# EAGLE design right (EAGLE 9.5.1)
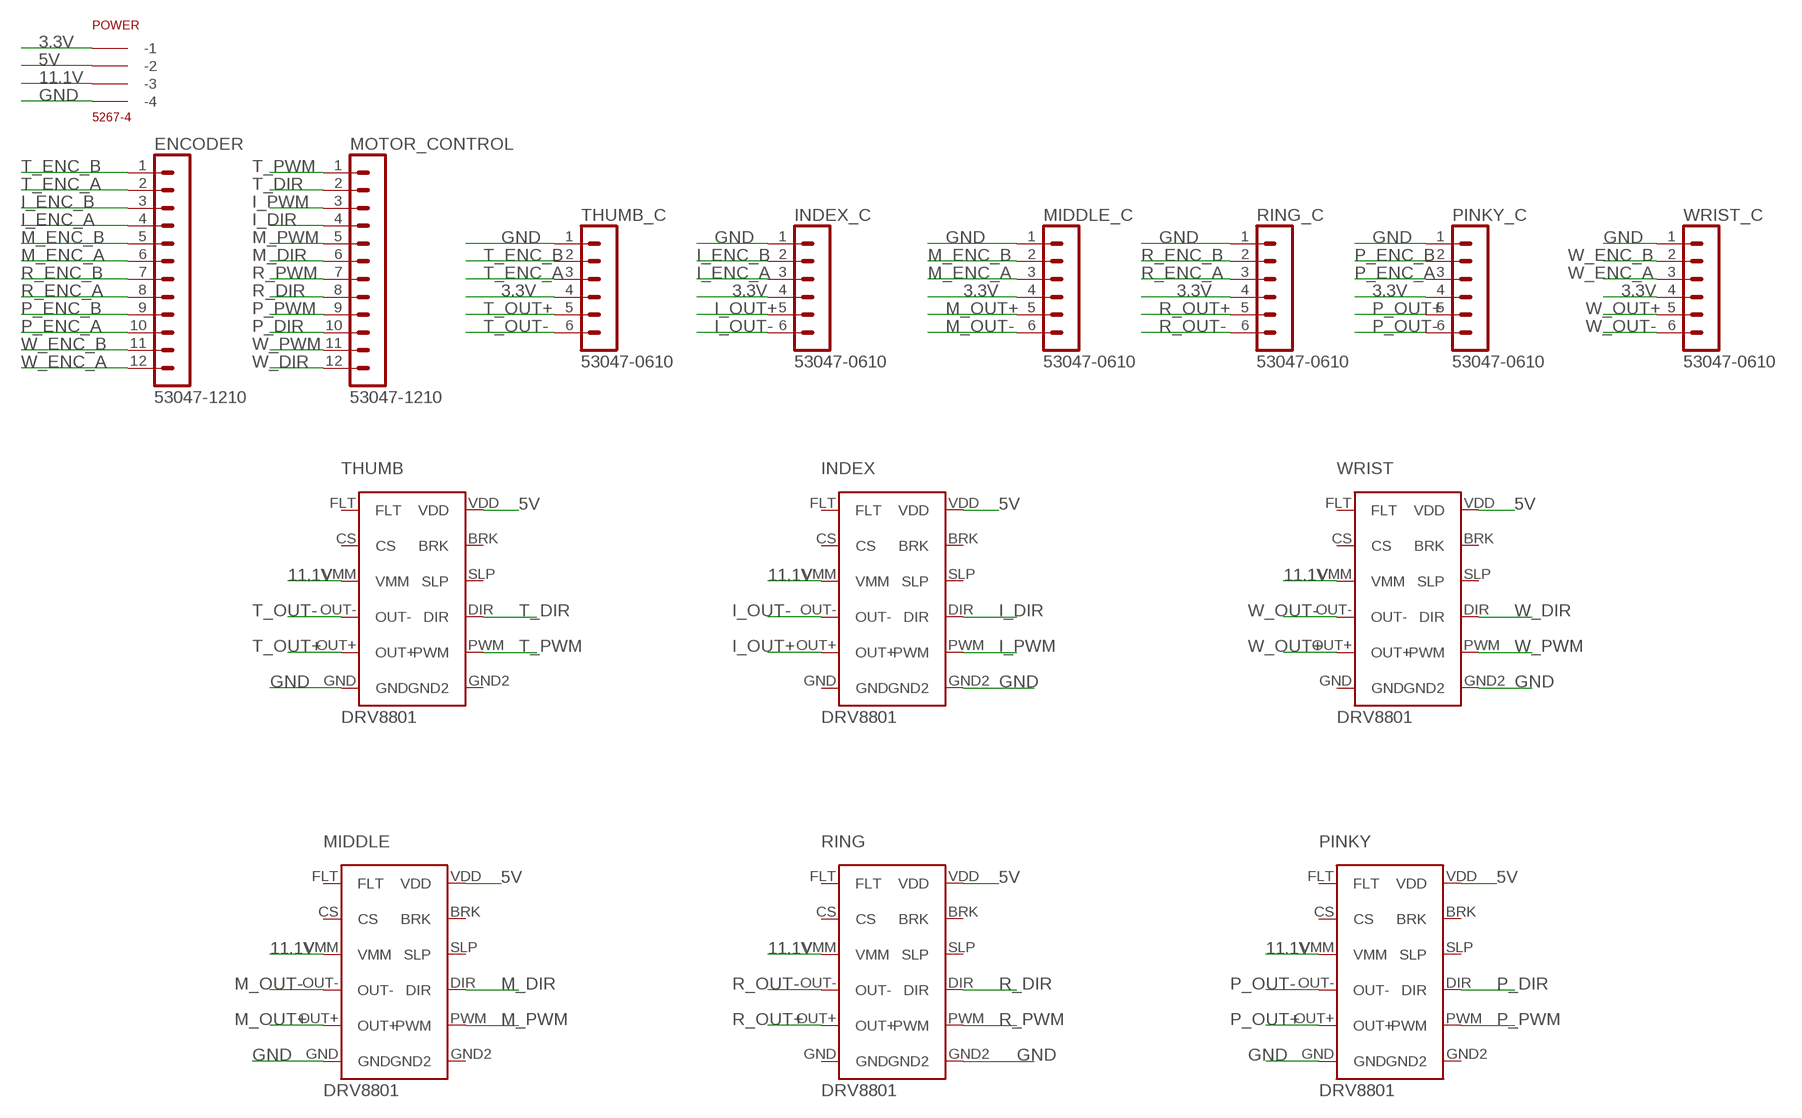
[diagram p0: schematic, sheet 1]

## Parts
ENCODER  53047-1210  [53047-1210]
INDEX  DRV8801  [DRV8801]
INDEX_C  53047-0610  [53047-0610]
MIDDLE  DRV8801  [DRV8801]
MIDDLE_C  53047-0610  [53047-0610]
MOTOR_CONTROL  53047-1210  [53047-1210]
PINKY  DRV8801  [DRV8801]
PINKY_C  53047-0610  [53047-0610]
POWER  5267-4  [5267-4]
RING  DRV8801  [DRV8801]
RING_C  53047-0610  [53047-0610]
THUMB  DRV8801  [DRV8801]
THUMB_C  53047-0610  [53047-0610]
WRIST  DRV8801  [DRV8801]
WRIST_C  53047-0610  [53047-0610]

## Nets
3.3V: INDEX_C.4 MIDDLE_C.4 PINKY_C.4 POWER.P$1(-1) RING_C.4 THUMB_C.4 WRIST_C.4
5V: INDEX.VDD MIDDLE.VDD PINKY.VDD POWER.P$2(-2) RING.VDD THUMB.VDD WRIST.VDD
11.1V: INDEX.VMM MIDDLE.VMM PINKY.VMM POWER.P$3(-3) RING.VMM THUMB.VMM WRIST.VMM
GND: INDEX.GND2 INDEX_C.1 MIDDLE.GND MIDDLE_C.1 PINKY.GND PINKY_C.1 POWER.P$4(-4) RING.GND2 RING_C.1 THUMB.GND THUMB_C.1 WRIST.GND2 WRIST_C.1
I_DIR: INDEX.DIR MOTOR_CONTROL.4
I_ENC_A: ENCODER.4 INDEX_C.3
I_ENC_B: ENCODER.3 INDEX_C.2
I_OUT+: INDEX.OUT+ INDEX_C.5
I_OUT-: INDEX.OUT- INDEX_C.6
I_PWM: INDEX.PWM MOTOR_CONTROL.3
M_DIR: MIDDLE.DIR MOTOR_CONTROL.6
M_ENC_A: ENCODER.6 MIDDLE_C.3
M_ENC_B: ENCODER.5 MIDDLE_C.2
M_OUT+: MIDDLE.OUT+ MIDDLE_C.5
M_OUT-: MIDDLE.OUT- MIDDLE_C.6
M_PWM: MIDDLE.PWM MOTOR_CONTROL.5
P_DIR: MOTOR_CONTROL.10 PINKY.DIR
P_ENC_A: ENCODER.10 PINKY_C.3
P_ENC_B: ENCODER.9 PINKY_C.2
P_OUT+: PINKY.OUT+ PINKY_C.5
P_OUT-: PINKY.OUT- PINKY_C.6
P_PWM: MOTOR_CONTROL.9 PINKY.PWM
R_DIR: MOTOR_CONTROL.8 RING.DIR
R_ENC_A: ENCODER.8 RING_C.3
R_ENC_B: ENCODER.7 RING_C.2
R_OUT+: RING.OUT+ RING_C.5
R_OUT-: RING.OUT- RING_C.6
R_PWM: MOTOR_CONTROL.7 RING.PWM
T_DIR: MOTOR_CONTROL.2 THUMB.DIR
T_ENC_A: ENCODER.2 THUMB_C.3
T_ENC_B: ENCODER.1 THUMB_C.2
T_OUT+: THUMB.OUT+ THUMB_C.5
T_OUT-: THUMB.OUT- THUMB_C.6
T_PWM: MOTOR_CONTROL.1 THUMB.PWM
W_DIR: MOTOR_CONTROL.12 WRIST.DIR
W_ENC_A: ENCODER.12 WRIST_C.3
W_ENC_B: ENCODER.11 WRIST_C.2
W_OUT+: WRIST.OUT+ WRIST_C.5
W_OUT-: WRIST.OUT- WRIST_C.6
W_PWM: MOTOR_CONTROL.11 WRIST.PWM
Unconnected: INDEX.BRK INDEX.CS INDEX.FLT INDEX.GND INDEX.SLP MIDDLE.BRK MIDDLE.CS MIDDLE.FLT MIDDLE.GND2 MIDDLE.SLP PINKY.BRK PINKY.CS PINKY.FLT PINKY.GND2 PINKY.SLP RING.BRK RING.CS RING.FLT RING.GND RING.SLP THUMB.BRK THUMB.CS THUMB.FLT THUMB.GND2 THUMB.SLP WRIST.BRK WRIST.CS WRIST.FLT WRIST.GND WRIST.SLP

## Library data of the parts
ENCODER MOTOR_CONTROL = con-molex-picoblade:53047-1210: HEADER
INDEX MIDDLE PINKY RING THUMB WRIST = DRV8801:DRV8801
INDEX_C MIDDLE_C PINKY_C RING_C THUMB_C WRIST_C = con-molex-picoblade:53047-0610: HEADER
POWER = con-molex-spox:5267-4

## Board
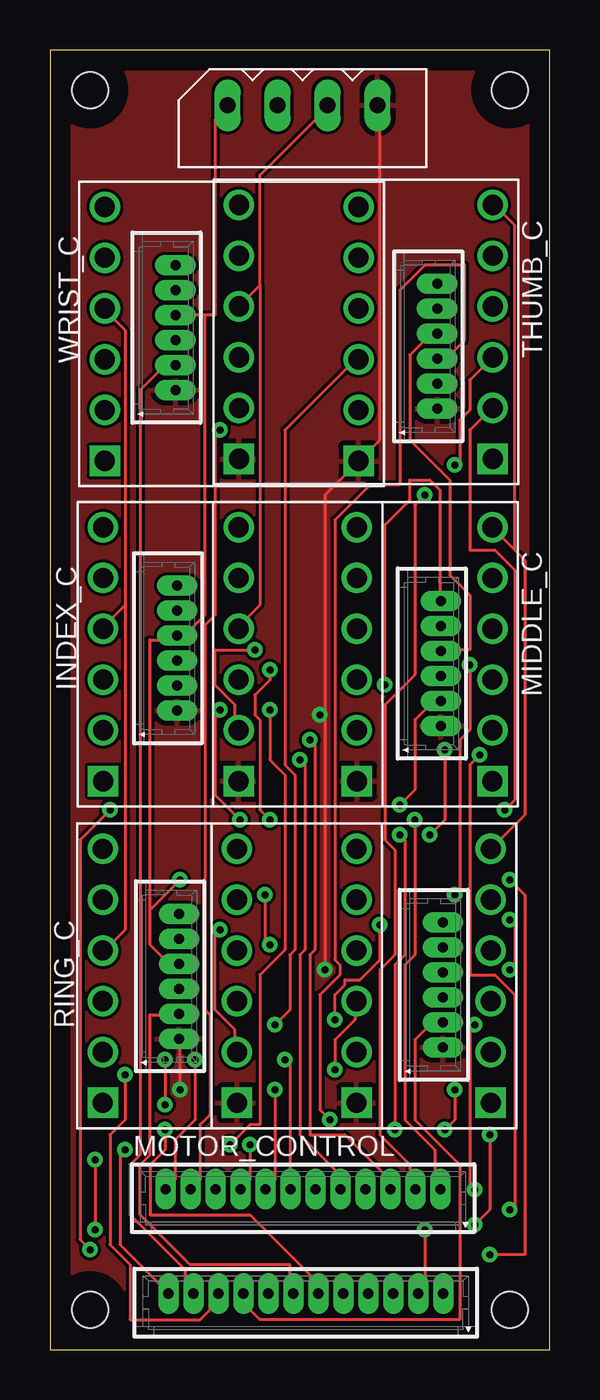
[diagram p1: board, top side]
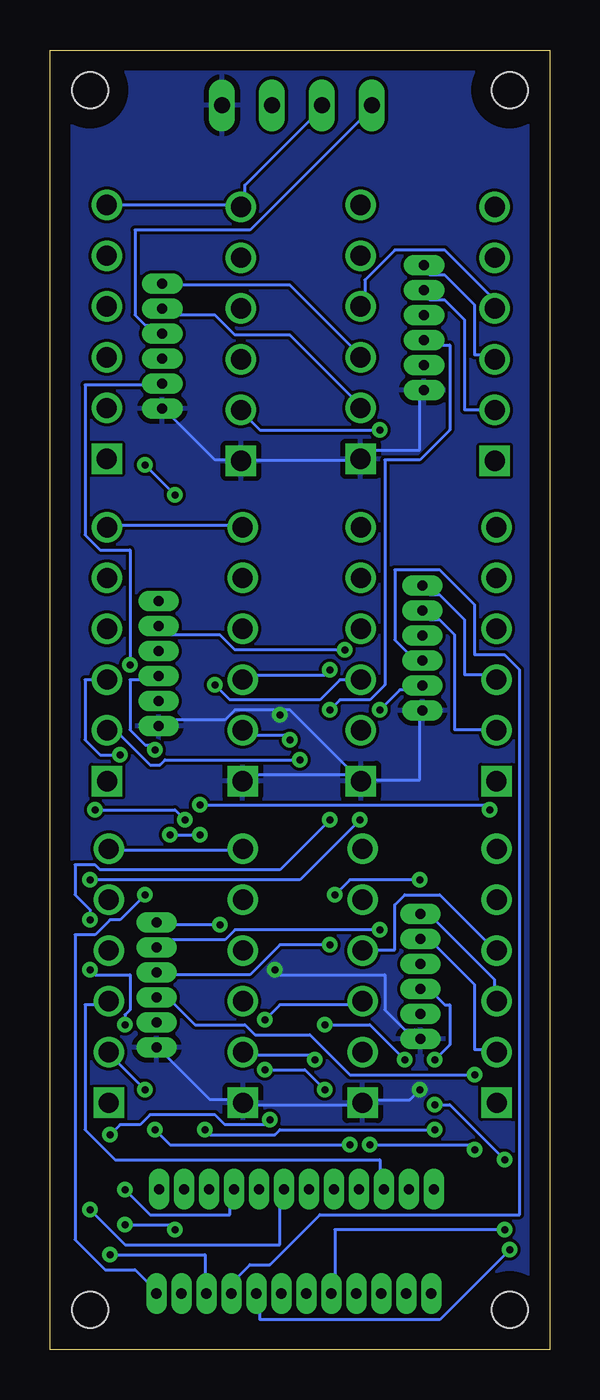
[diagram p2: board, bottom side, seen from below]

Size 25 x 65 mm. Coordinates in mm from the lower left corner, seen from the top.
Outline: 0,0 25,0 25,65 0,65 0,0
Copper layers (1*16): Top 0.035mm / dielectric 1.5mm / Bottom 0.035mm
Design rules "default": minimum track width 6mil, minimum drill 0.35mm, track to track 6mil, track to pad 6mil, pad to pad 6mil, via to via 6mil, smd to smd 6mil, copper to edge 40mil, drill to drill 6mil, minimum pad ring 10mil, minimum via ring 8mil, stop-mask expansion 4mil, vias tented up to drill 0mil, thermal gap 10mil
Holes 1.8 mm at 23,63 2,63 2,2 23,2

### Footprints (pad centres in the part's own frame; a part is rotated, then mirrored left to right if it is on the bottom)
53047-1210 = drill 0.508 long: 1 6.875,0; 2 5.625,0; 3 4.375,0; 4 3.125,0; 5 1.875,0; 6 0.625,0; 7 -0.625,0; 8 -1.875,0; 9 -3.125,0; 10 -4.375,0; 11 -5.625,0; 12 -6.875,0
DRV8801 = drill 1.016: BRK 6.35,3.81; CS -6.35,3.81; DIR 6.35,-1.27; FLT -6.35,6.35; OUT+ -6.35,-3.81; OUT- -6.35,-1.27; PWM 6.35,-3.81; SLP 6.35,1.27; VDD 6.35,6.35; VMM -6.35,1.27 | drill 1.016 square: GND -6.35,-6.35; GND2 6.35,-6.35
53047-0610 = drill 0.508 long: 1 3.125,0; 2 1.875,0; 3 0.625,0; 4 -0.625,0; 5 -1.875,0; 6 -3.125,0
5267-4 = drill 0.8 long: P$1 0,0; P$2 2.5,0; P$3 5,0; P$4 7.5,0

### Placement (x,y rotation side)
ENCODER  12.8,2.8 0 top
INDEX  9.01,34.78 0 top
INDEX_C  6.36,35.08 270 top
MIDDLE  15.79,34.78 0 top
MIDDLE_C  19.56,34.31 270 top
MOTOR_CONTROL  12.67,8.02 0 top
PINKY  15.71,18.69 0 top
PINKY_C  19.66,18.24 270 top
POWER  8.89,62.23 0 top
RING  8.99,18.69 0 top
RING_C  6.46,18.67 270 top
THUMB  15.81,50.9 0 top
THUMB_C  19.38,50.18 270 top
WRIST  9.09,50.8 0 top
WRIST_C  6.28,51.11 270 top

### Tracks (layer width: path | path; a pad name or v marks a point on that pad's centre or on a via)
3.3V  (via drill 0.35)
  Top 0.152: MIDDLE_C.4 19.75,35 21,35 21,37.75 20,38.75 20,43.5 18,45.5 18,49.75 19.25,51 THUMB_C.4 | 7.75,51.75 8.25,51.75 8.25,61.5 8.75,62 POWER.P$1 | 7.75,51.75 6.5,51.75 WRIST_C.4 | v11,20.25 10.75,20.5 v10.75,22.75 | 5,22 v6.5,23.5 | 5,22 5,20.25 5.75,19.5 6.25,19.5 RING_C.4 | 5,22 5,35.5 6.25,35.5 INDEX_C.4 6.5,35.5 7.75,36.75 7.75,51.75
  Bottom 0.152: v11,20.25 13.5,20.25 15,18.75 19.5,18.75 PINKY_C.4 | v10.75,22.75 10,23.5 v6.5,23.5 | THUMB_C.4 19.5,51 19.75,51.25 20.25,51.25 20.75,51.75 20.75,56 15,56 9,62 POWER.P$1
5V
  Top 0.152: 23.25,40 22.25,41 MIDDLE.VDD | 23.25,40 23.75,39.5 23.75,26.75 22.25,25.25 PINKY.VDD | 23.25,40 23.25,56.25 22.25,57.25 THUMB.VDD
  Bottom 0.152: POWER.P$2 11.5,62 15.25,58.25 15.25,57.25 WRIST.VDD 15.5,57.25 THUMB.VDD | RING.VDD 15.5,25 22,25 PINKY.VDD | INDEX.VDD 15.5,41.25 22,41.25 MIDDLE.VDD
11.1V
  Top 0.152: 10.5,53.25 10.5,58.75 13.75,62 POWER.P$3 | 10.5,53.25 9.5,52.25 THUMB.VMM | 10.5,53.25 10.5,37.25 9.5,36.25 MIDDLE.VMM | 3.75,37.25 2.75,36.25 INDEX.VMM | 3.75,37.25 3.75,51 2.75,52 WRIST.VMM | 3.75,37.25 3.75,21 2.75,20 RING.VMM
  Bottom 0.152: RING.VMM 2.75,20 5.5,22.75 7.25,22.75 7.75,22.25 7.75,20 9.25,20 PINKY.VMM | THUMB.VMM 9.25,52.25 9.25,53.5 7.75,55 5.25,55 2.5,52.25 WRIST.VMM
GND  (via drill 0.35)
  Top 0.152: v6.5,13 6.5,15.5 RING_C.1 | POWER.P$4 16.5,62 16.5,45.5 15.5,44.5 WRIST.GND2 15.25,44.25 13.75,42.75 13.75,31.75 | 13.75,31.75 v13.75,19 | 13.75,31.75 v13.5,31.75
  Bottom 0.152: INDEX_C.1 6.5,31.75 6.5,28.5 9.25,28.5 MIDDLE.GND | 13.5,32 13,32 9.75,28.75 | 13.5,32 15.75,32 16.25,31.5 19.25,31.5 19.5,31.25 MIDDLE_C.1 | 9.75,28.75 9.5,28.5 MIDDLE.GND | 9.75,28.75 15,28.75 15.25,28.5 INDEX.GND2 | 9.75,28.75 MIDDLE.GND | v6.5,13 7,12.5 9.25,12.5 PINKY.GND 9.5,12.25 15.25,12.25 RING.GND2 15.5,12.5 17,12.5 19.5,15 PINKY_C.1 | WRIST_C.1 6.5,47.75 6.5,45 9,45 9.25,44.75 THUMB.GND 9.5,44.5 15.25,44.5 WRIST.GND2 15.5,44.5 16.75,44.5 19.25,47 THUMB_C.1 | v13.75,19 13.5,18.75 8.25,18.75 8.25,17 7.25,16 6.75,16 6.5,15.75 RING_C.1 | v13.5,31.75 13.5,32
  pour Top: -4,68.8 -4,-2.7 33.3,-2.7 33.3,68.8
  pour Bottom: -10.9,72.8 -10.9,-8 45.4,-8 45.4,72.8
I_DIR  (via drill 0.35)
  Top 0.152: v21.25,8 21,8.25 21,16 v21.25,16.25 | v23,19 23.25,19.25 23.25,21.25 v23,21.5 | v11,26.5 10.5,27 10.5,31.5 10.25,31.75 10.25,32.75 11,33.5 v11,34
  Bottom 0.152: v21.25,8 20,6.75 16,6.75 16,8 MOTOR_CONTROL.4 | v21.25,16.25 21.25,16.75 21,17 21,18.75 22.75,18.75 v23,19 | v23,21.5 23,22 23.75,22.75 23.75,24.25 22.75,24.25 22.5,24 13.5,24 v11,26.5 | v11,34 11.25,33.75 15.25,33.75 INDEX.DIR
I_ENC_A
  Bottom 0.152: INDEX_C.3 6.5,34.5 6.75,34.75 7,34.75 7.75,35.5 7.75,39 5.5,39 3.75,37.25 3.75,34.75 2.25,34.75 1.5,34 1.5,6.75 11.5,6.75 14,4.25 15,4.25 15.75,3.5 15.75,3 ENCODER.4
I_ENC_B  (via drill 0.35)
  Top 0.152: v22,4.75 23.75,4.75 23.75,22.75 v23,23.5 | v9.5,26.5 8.25,27.75 8.25,31.75 v8.5,32
  Bottom 0.152: v22,4.75 17.25,4.75 17.25,3 ENCODER.3 | v23,23.5 12.5,23.5 v9.5,26.5 | v8.5,32 7.5,33 6.5,33 INDEX_C.2
I_OUT+
  Bottom 0.152: INDEX_C.5 6.25,36.75 6,36.5 5.5,36.5 4.75,35.75 4.75,31 2.75,31 INDEX.OUT+
I_OUT-
  Bottom 0.152: INDEX_C.6 6.25,38 6,37.75 5.5,37.75 4.25,36.5 4.25,33.75 2.75,33.75 INDEX.OUT-
I_PWM  (via drill 0.35)
  Top 0.152: v13,30.5 13.25,30.25 13.25,20 13,19.75 13,10.75 14.75,10.75 16.75,8.75 16.75,8.5 17,8.25 MOTOR_CONTROL.3
  Bottom 0.152: v13,30.5 13.25,30.75 15.25,30.75 INDEX.PWM
M_DIR  (via drill 0.35)
  Top 0.152: v23,7 23.25,7.25 23.25,17.75 22.25,18.75 21,18.75 21,29.25 v21.5,29.75
  Bottom 0.152: v23,7 21.25,5.25 13.5,5.25 13.5,8 MOTOR_CONTROL.6 | v21.5,29.75 22.5,29.75 23.25,30.5 23.25,33.5 22.25,33.5 MIDDLE.DIR
M_ENC_A  (via drill 0.35)
  Top 0.152: v5.75,11 5.75,10 5,9.25 5,6.75 10,6.75 13,3.75 13,3.25 13.25,3 ENCODER.6 | v17.25,11 17.25,19.25 17.75,19.75 17.75,25.5 v17.5,25.75 | v19,25.75 19.75,26.5 v19.75,30
  Bottom 0.152: v5.75,11 13.5,11 13.75,10.75 17,10.75 v17.25,11 | v19,25.75 v17.5,25.75 | v19.75,30 20,30.25 20.25,30.25 21,31 21,33.5 19.75,33.5 MIDDLE_C.3
M_ENC_B  (via drill 0.35)
  Top 0.152: v2,5 1.5,5.5 1.5,25.5 v3,27 | v17.5,27.25 18.25,28 18.25,31.5 19,32.25 19.5,32.25 MIDDLE_C.2
  Bottom 0.152: v2,5 5.5,1.5 14.5,1.5 14.5,2.75 ENCODER.5 | v3,27 3.25,27.25 v17.5,27.25
M_OUT+  (via drill 0.35)
  Top 0.152: v10.25,35 8.25,35 8.25,33.25 9.25,32.25 9.25,31 MIDDLE.OUT+
  Bottom 0.152: v10.25,35 15.75,35 16.5,35.75 19.25,35.75 19.5,36 MIDDLE_C.5
M_OUT-  (via drill 0.35)
  Top 0.152: v16.75,33.25 16.75,41.25 18,42.5 18,43.5 19,43.5 19.5,43 19.5,37.5 MIDDLE_C.6
  Bottom 0.152: v16.75,33.25 16,32.5 11.5,32.5 10.5,33.5 9.5,33.5 MIDDLE.OUT-
M_PWM  (via drill 0.35)
  Top 0.152: v12.5,29.5 12.75,29.25 12.75,20 12.5,19.75 12.5,10.75 14.25,9 14.25,8.5 14.5,8.25 MOTOR_CONTROL.5
  Bottom 0.152: v12.5,29.5 19.25,29.5 19.5,29.25 20,29.25 21.5,30.75 22,30.75 MIDDLE.PWM
P_DIR
  Bottom 0.152: MOTOR_CONTROL.10 8.5,8.25 8.5,9.5 21.75,9.5 23.25,11 23.25,17.25 22.25,17.25 PINKY.DIR
P_ENC_A  (via drill 0.35)
  Top 0.152: v3.75,13.75 3.75,11.5 3,10.75 3,5.25 4,4.25 4,1.5 7.5,1.5 8,2 8,2.5 8.25,2.75 ENCODER.10
  Bottom 0.152: v3.75,13.75 10,13.75 12,15.75 14.75,15.75 15.25,16.25 17.75,16.25 19,17.5 19.5,17.5 PINKY_C.3
P_ENC_B
  Top 0.152: ENCODER.9 9.75,2.75 10,2.5 10,2 10.5,1.5 20.5,1.5 20.5,9.25 18.25,11.5 18.25,15.5 19,16.25 19.5,16.25 PINKY_C.2
P_OUT+  (via drill 0.35)
  Top 0.152: v8.5,21 8.25,20.75 8.25,17 9.25,16 9.25,15 PINKY.OUT+
  Bottom 0.152: v8.5,21 15.75,21 16.25,20.5 19.25,20.5 19.5,20.25 PINKY_C.5
P_OUT-  (via drill 0.35)
  Top 0.152: v16.5,21.25 16.5,19.5 15.5,18.5 14.75,18.5 14.75,18.25 14.25,17.75 v14.25,16.5
  Bottom 0.152: v16.5,21.25 19.5,21.25 PINKY_C.6 | v14.25,16.5 13.5,17.25 9.5,17.25 PINKY.OUT-
P_PWM  (via drill 0.35)
  Top 0.152: v10,10.25 10,8.5 9.75,8.25 MOTOR_CONTROL.9 | v19.75,11 20.25,11.5 v20.25,13
  Bottom 0.152: v10,10.25 19,10.25 v19.75,11 | v20.25,13 22,14.75 PINKY.PWM
R_DIR  (via drill 0.35)
  Top 0.152: v11.25,13 11.25,8.5 11,8.25 MOTOR_CONTROL.8 | v14.25,14 14.25,15.5 15.25,16.5 15.25,17.25 RING.DIR
  Bottom 0.152: v11.25,13 12.25,14 v14.25,14
R_ENC_A  (via drill 0.35)
  Top 0.152: v2.25,9.5 v2.25,6 | v5.75,14.5 v5.75,12.25
  Bottom 0.152: v2.25,6 10.75,6 10.75,3 ENCODER.8 | v2.25,9.5 5,12.25 v5.75,12.25 | v5.75,14.5 5,15.25 5,17.25 5.25,17.25 6,18 6.25,18 RING_C.3
R_ENC_B
  Top 0.152: RING_C.2 6.25,16.75 5,16.75 5,9.75 4.5,9.25 4.5,6.75 7,4.25 12,4.25 12,3 ENCODER.7
R_OUT+
  Bottom 0.152: RING_C.5 6.25,20.5 6,20.25 5.75,20.25 3.75,18.25 3.75,15 2.75,15 RING.OUT+
R_OUT-
  Bottom 0.152: RING_C.6 6.25,21.75 6,21.5 5.75,21.5 2.75,18.5 2.75,17.5 RING.OUT-
R_PWM  (via drill 0.35)
  Top 0.152: v11.75,14.5 12,14.25 12,8.25 MOTOR_CONTROL.7
  Bottom 0.152: v11.75,14.5 12,14.75 15.25,14.75 RING.PWM
T_DIR  (via drill 0.35)
  Top 0.152: v18.75,42.75 18.25,42.25 18.25,33.75 16.75,32.25 16.75,25.5 17.25,25 17.25,19.75 16.5,19 16.5,10.75 18,9.25 18,8.5 18.25,8.25 MOTOR_CONTROL.2 | v20.25,44.25 20.5,44.5 20.5,46.5 21,47 21,48.5 22,49.5 THUMB.DIR
  Bottom 0.152: v20.25,44.25 v18.75,42.75
T_ENC_A  (via drill 0.35)
  Top 0.152: v18.75,6 18.75,3.25 18.5,3 ENCODER.2 | v21.25,6.25 22,7 v22,10.75 | v14,11.5 13.5,12 13.5,17.75 14.5,18.75 14.5,19.25 14.25,19.5 14.25,41.5 16,43.25 17.5,43.25 17.5,53 18.75,54.25 20.75,54.25 20.75,50.5 20,49.75 19.5,49.75 THUMB_C.3
  Bottom 0.152: v18.75,6 19,6.25 v21.25,6.25 | v22,10.75 21.5,11.25 20.5,11.25 20,11.75 16.75,11.75 16.25,11.25 14.25,11.25 v14,11.5
T_ENC_B  (via drill 0.35)
  Top 0.152: v20.25,22.75 20.5,23 20.5,30.5 21,31 v21,34.25
  Bottom 0.152: v20.25,22.75 21.5,21.5 22,21.5 22.75,20.75 23.75,20.75 23.75,5.5 22.25,4 20.75,4 19.75,3 ENCODER.1 | v21,34.25 21,40 22.5,40 23.25,40.75 23.25,48.25 19.5,48.25 THUMB_C.2
T_OUT+
  Bottom 0.152: THUMB_C.5 19.25,52 19,51.75 16.75,51.75 15.75,50.75 13,50.75 9.5,47.25 THUMB.OUT+
T_OUT-
  Bottom 0.152: THUMB_C.6 19.25,53.25 13,53.25 9.5,49.75 THUMB.OUT-
T_PWM  (via drill 0.35)
  Top 0.152: v18.25,26.5 18.25,19.75 17.75,19.25 17.75,11.5 19.25,10 19.25,8.5 19.5,8.25 MOTOR_CONTROL.1 | v22.75,27 23.25,27.5 23.25,39 22.25,40 21,40 21,46 22,47 THUMB.PWM
  Bottom 0.152: v18.25,26.5 18.75,27 v22.75,27
W_DIR  (via drill 0.35)
  Top 0.152: v7.25,14.5 7.25,11.5 6.25,10.5 6.25,8.5 6,8.25 MOTOR_CONTROL.12 | v11.25,16.25 12,17 12,19.75 12.25,20 12.25,28.75 11.75,29.25 11.75,46 15.25,49.5 WRIST.DIR
  Bottom 0.152: v7.25,14.5 9,16.25 v11.25,16.25
W_ENC_A  (via drill 0.35)
  Top 0.152: v3.75,10 3.5,9.75 3.5,5.25 5.75,3 ENCODER.12 | v9,10.25 10,11.25 10.5,11.25 10.5,18.75 11.75,20 11.75,28.75 11,29.5 v11,32
  Bottom 0.152: v3.75,10 4,10.25 v9,10.25 | v11,32 10.5,32.5 9,32.5 8.25,33.25 8.25,44.5 6.5,44.5 5,46 5,50.25 6.25,50.25 WRIST_C.3
W_ENC_B
  Top 0.152: ENCODER.11 7,3 6.75,3.25 6.75,4 4,6.75 4,9.25 4.5,9.75 4.5,48 5.5,49 6.25,49 WRIST_C.2
W_OUT+
  Bottom 0.152: WRIST_C.5 6.25,52.75 6,52.5 5.25,52.5 4.25,51.5 4.25,47 WRIST.OUT+
W_OUT-
  Bottom 0.152: WRIST_C.6 6.25,54 6,53.75 5.25,53.75 3.75,52.25 3.75,49.75 2.75,49.75 WRIST.OUT-
W_PWM  (via drill 0.35)
  Top 0.152: v8.5,46 8.25,45.75 8.25,36.75 7.75,36.25 7.75,17 8,16.75 8,11.75 7.5,11.25 7.5,8.5 7.25,8.25 MOTOR_CONTROL.11
  Bottom 0.152: v8.5,46 14.5,46 15.25,46.75 WRIST.PWM